# Altium schematic sheet output_drivers.SchDoc
size A4; SheetNumber: 7; SheetTotal: 8
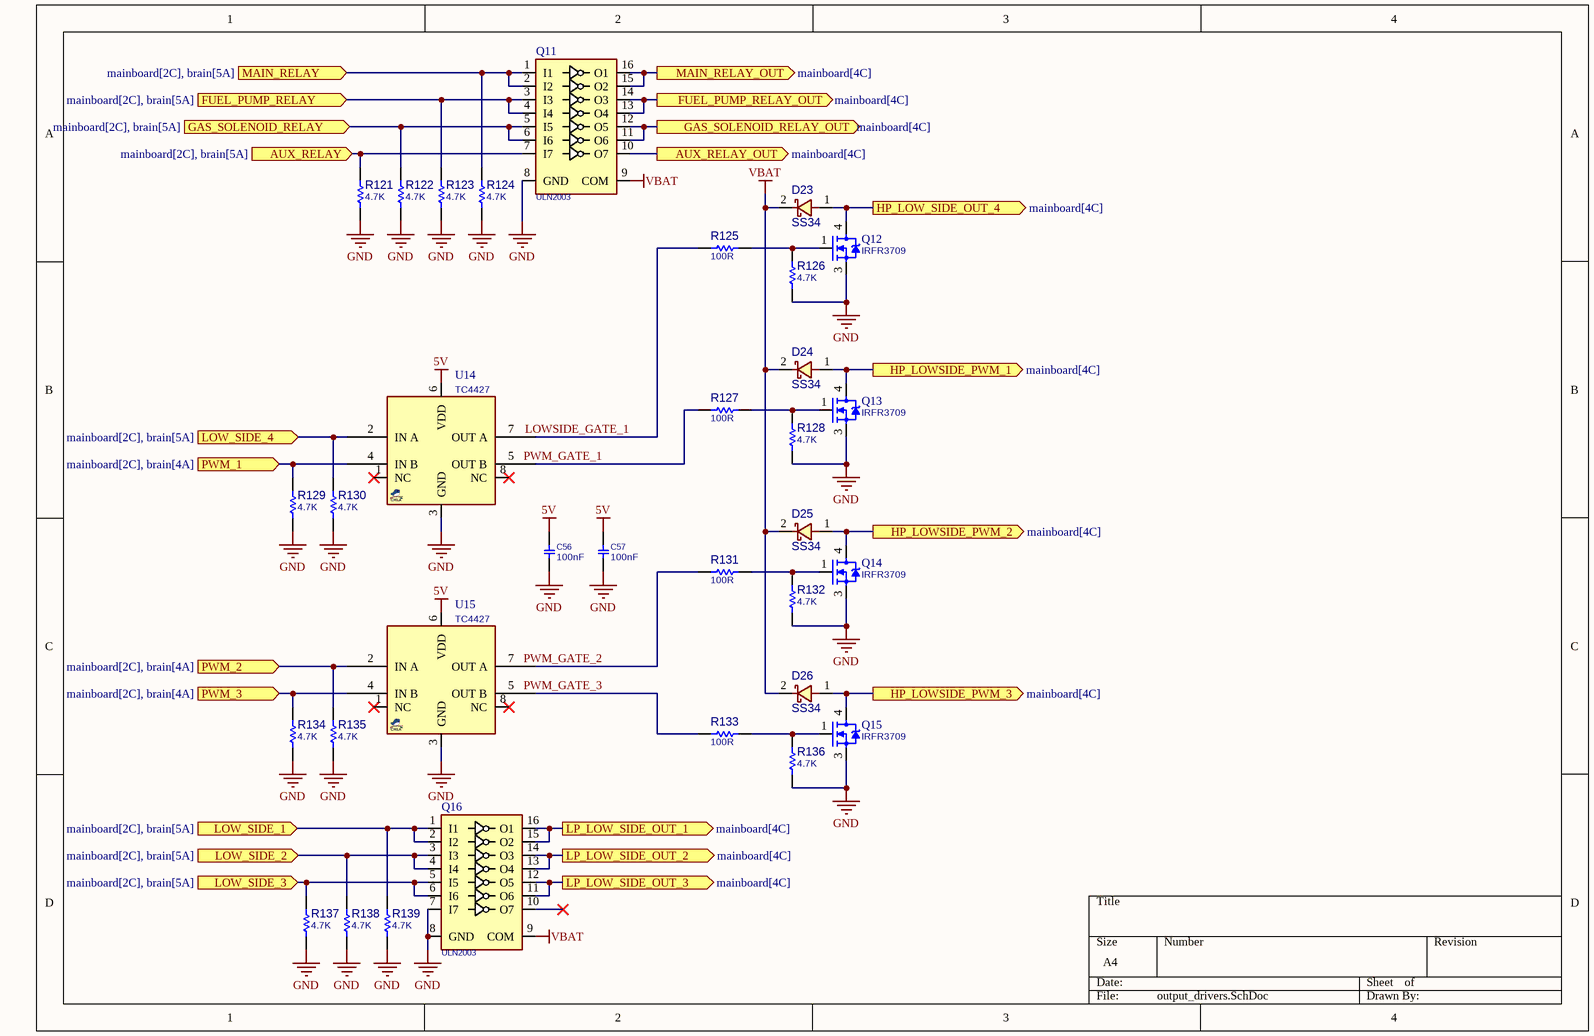
[diagram p0: output_drivers.SchDoc]

## Parts
C56  100nF  [C1206]
C57  100nF  [C1206]
D23  SS34  [D_SMB]
D24  SS34  [D_SMB]
D25  SS34  [D_SMB]
D26  SS34  [D_SMB]
Q11  ULN2003  [SO_16_W]
Q12  IRFR3709  [DPAK_3]
Q13  IRFR3709  [DPAK_3]
Q14  IRFR3709  [DPAK_3]
Q15  IRFR3709  [DPAK_3]
Q16  ULN2003  [SO_16_W]
R121  4.7K  [R0805]
R122  4.7K  [R0805]
R123  4.7K  [R0805]
R124  4.7K  [R0805]
R125  100R  [R1206]
R126  4.7K  [R0805]
R127  100R  [R1206]
R128  4.7K  [R0805]
R129  4.7K  [R0805]
R130  4.7K  [R0805]
R131  100R  [R1206]
R132  4.7K  [R0805]
R133  100R  [R1206]
R134  4.7K  [R0805]
R135  4.7K  [R0805]
R136  4.7K  [R0805]
R137  4.7K  [R0805]
R138  4.7K  [R0805]
R139  4.7K  [R0805]
U14  TC4427  [SO_8]
U15  TC4427  [SO_8]

## Ports
AUX_RELAY (in, see mainboard[2C], brain[5A]), AUX_RELAY_OUT (out, see mainboard[4C]), FUEL_PUMP_RELAY (in, see mainboard[2C], brain[5A]), FUEL_PUMP_RELAY_OUT (out, see mainboard[4C]), GAS_SOLENOID_RELAY (in, see mainboard[2C], brain[5A]), GAS_SOLENOID_RELAY_OUT (out, see mainboard[4C]), HP_LOW_SIDE_OUT_4 (out, see mainboard[4C]), HP_LOWSIDE_PWM_1 (out, see mainboard[4C]), HP_LOWSIDE_PWM_2 (out, see mainboard[4C]), HP_LOWSIDE_PWM_3 (out, see mainboard[4C]), LOW_SIDE_1 (in, see mainboard[2C], brain[5A]), LOW_SIDE_2 (in, see mainboard[2C], brain[5A]), LOW_SIDE_3 (in, see mainboard[2C], brain[5A]), LOW_SIDE_4 (in, see mainboard[2C], brain[5A]), LP_LOW_SIDE_OUT_1 (out, see mainboard[4C]), LP_LOW_SIDE_OUT_2 (out, see mainboard[4C]), LP_LOW_SIDE_OUT_3 (out, see mainboard[4C]), MAIN_RELAY (in, see mainboard[2C], brain[5A]), MAIN_RELAY_OUT (out, see mainboard[4C]), PWM_1 (in, see mainboard[2C], brain[4A]), PWM_2 (in, see mainboard[2C], brain[4A]), PWM_3 (in, see mainboard[2C], brain[4A])

## Nets
5V: C56.2 C57.2 U14.6(VDD) U15.6(VDD)
GND: C56.1 C57.1 Q11.8(GND) Q12.3(S) Q13.3(S) Q14.3(S) Q15.3(S) Q16.7(I7) Q16.8(GND) R121.1 R122.1 R123.1 R124.1 R126.1 R128.1 R129.1 R130.1 R132.1 R134.1 R135.1 R136.1 R137.1 R138.1 R139.1 U14.3(GND) U15.3(GND)
VBAT: D23.2 D24.2 D25.2 D26.2 Q11.9(COM) Q16.9(COM)
AUX_RELAY: Q11.7(I7) R121.2 ; port AUX_RELAY
AUX_RELAY_OUT: Q11.10(O7) ; port AUX_RELAY_OUT
FUEL_PUMP_RELAY: Q11.3(I3) Q11.4(I4) R123.2 ; port FUEL_PUMP_RELAY
FUEL_PUMP_RELAY_OUT: Q11.13(O4) Q11.14(O3) ; port FUEL_PUMP_RELAY_OUT
GAS_SOLENOID_RELAY: Q11.5(I5) Q11.6(I6) R122.2 ; port GAS_SOLENOID_RELAY
GAS_SOLENOID_RELAY_OUT: Q11.11(O6) Q11.12(O5) ; port GAS_SOLENOID_RELAY_OUT
HP_LOW_SIDE_OUT_4: D23.1 Q12.4(D) ; port HP_LOW_SIDE_OUT_4
HP_LOWSIDE_PWM_1: D24.1 Q13.4(D) ; port HP_LOWSIDE_PWM_1
HP_LOWSIDE_PWM_2: D25.1 Q14.4(D) ; port HP_LOWSIDE_PWM_2
HP_LOWSIDE_PWM_3: D26.1 Q15.4(D) ; port HP_LOWSIDE_PWM_3
LOW_SIDE_1: Q16.1(I1) Q16.2(I2) R139.2 ; port LOW_SIDE_1
LOW_SIDE_2: Q16.3(I3) Q16.4(I4) R138.2 ; port LOW_SIDE_2
LOW_SIDE_3: Q16.5(I5) Q16.6(I6) R137.2 ; port LOW_SIDE_3
LOW_SIDE_4: R130.2 U14.2(IN_A) ; port LOW_SIDE_4
LOWSIDE_GATE_1: R125.1 U14.7(OUT_A)
LP_LOW_SIDE_OUT_1: Q16.15(O2) Q16.16(O1) ; port LP_LOW_SIDE_OUT_1
LP_LOW_SIDE_OUT_2: Q16.13(O4) Q16.14(O3) ; port LP_LOW_SIDE_OUT_2
LP_LOW_SIDE_OUT_3: Q16.11(O6) Q16.12(O5) ; port LP_LOW_SIDE_OUT_3
MAIN_RELAY: Q11.1(I1) Q11.2(I2) R124.2 ; port MAIN_RELAY
MAIN_RELAY_OUT: Q11.15(O2) Q11.16(O1) ; port MAIN_RELAY_OUT
PWM_1: R129.2 U14.4(IN_B) ; port PWM_1
PWM_2: R135.2 U15.2(IN_A) ; port PWM_2
PWM_3: R134.2 U15.4(IN_B) ; port PWM_3
PWM_GATE_1: R127.2 U14.5(OUT_B)
PWM_GATE_2: R131.2 U15.7(OUT_A)
PWM_GATE_3: R133.2 U15.5(OUT_B)
NetQ12_1: Q12.1(G) R125.2 R126.2
NetQ13_1: Q13.1(G) R127.1 R128.2
NetQ14_1: Q14.1(G) R131.1 R132.2
NetQ15_1: Q15.1(G) R133.1 R136.2

Not connected (* = marked no-connect by the designer): Q16 10(O7)*; U14 1(NC)* 8(NC)*; U15 1(NC)* 8(NC)*

## Library data of the parts
C56 C57 = CAP_SMD_MLCC: CAP, MLCC; PARAM: C0G, 10%; DESC: CAP, MLCC, 1nF, 50V, C0G, 10%, 0402; MANF_P#: MANF_PART#; MANF: Murata; PARAM2: 50V; PRICE: 100= 1$; ASSEMBLY: ASSEMBLY; VALUE: 100nF
D23-D26 = DIODE_SMD_SCHOTTKY_SS34: DIODE, SCHOTTKY, 20V, 3A; MANF: VISHAY; DESC: DESCRIPTION; MANF_P#: SS34; ASSEMBLY: ASSEMBLY; PRICE: PRICE; PARAM2: 3A; PARAM: 20V; VALUE: SS34
Q11 Q16 = ULN2003_SOP16: Darlington, 7-CH, 50V, 0.5A; MANF_P#: ULN2003A; MANF: DIODES; PARAM: 7-CH, 50V, 0.5A; PARAM2: -; VALUE: ULN2003
Q12-Q15 = MOSN_IRFR3709_DPAK: MOSFET, N-CH, 30V, 86A, 6.5mRDS, 2300pF; DESC: HEXFET Power MOSFET; MANF_P#: IRFR3709Z; PARAM2: 30VDS, 1.3~2.2VGSth; PARAM: 86A, 6.5mRDS, 2300pF, -55~175oC; ASSEMBLY: ASSEMBLY; PRICE: 1500t@PAYA; VALUE: IRFR3709
R121-R124 R126 R128-R130 R132 R134-R139 = RES_SMD_0805: RESISTOR, SMD; PARAM: -W; DESC: DESCRIPTION; DIST#: MOUSER; PARAM2: 1%; MANF_P#: -; MANF: -; ASSEMBLY: ASSEMBLY; PRICE: 100= 0.5$; VALUE: 4.7K
R125 R127 R131 R133 = RES_SMD_1206: RESISTOR, SMD; PARAM: 1%, 0.25W; DESC: DESCRIPTION; DIST#: MOUSER; MANF_P#: -; MANF: -; ASSEMBLY: ASSEMBLY; PRICE: -; PARAM2: -; VALUE: 100R
U14 U15 = MOS_DUAL_TC4427: power Mosfet Driver, Dual, High-Speed, 1.5A; ASSEMBLY: ASSEMBLY; MANF_P#: TC4427; VALUE: TC4427